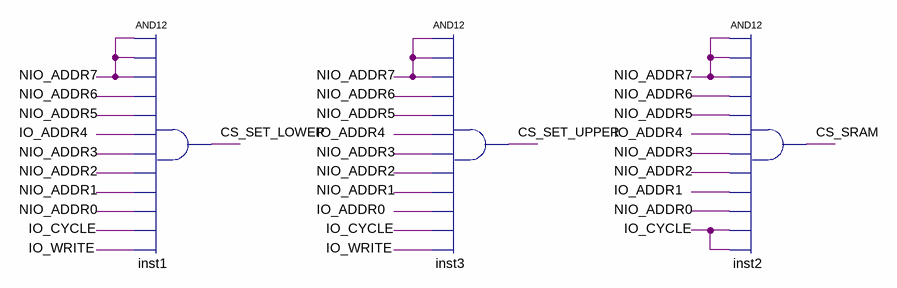
[diagram p0: schematic sheet]
// Quartus schematic Decoders.bdf as structural Verilog: 3 symbols, 0 pins
module Decoders (
);

  wire CS_SET_LOWER, CS_SET_UPPER, CS_SRAM, IO_ADDR0, IO_ADDR1, IO_ADDR4, IO_CYCLE, IO_WRITE, NIO_ADDR0,
       NIO_ADDR1, NIO_ADDR2, NIO_ADDR3, NIO_ADDR5, NIO_ADDR6, NIO_ADDR7;

  and inst1 (CS_SET_LOWER, NIO_ADDR7, NIO_ADDR7, NIO_ADDR7, NIO_ADDR6, NIO_ADDR5, IO_ADDR4, NIO_ADDR3, NIO_ADDR2, NIO_ADDR1, NIO_ADDR0, IO_CYCLE, IO_WRITE);
  and inst3 (CS_SET_UPPER, NIO_ADDR7, NIO_ADDR7, NIO_ADDR7, NIO_ADDR6, NIO_ADDR5, IO_ADDR4, NIO_ADDR3, NIO_ADDR2, NIO_ADDR1, IO_ADDR0, IO_CYCLE, IO_WRITE);
  and inst2 (CS_SRAM, NIO_ADDR7, NIO_ADDR7, NIO_ADDR7, NIO_ADDR6, NIO_ADDR5, IO_ADDR4, NIO_ADDR3, NIO_ADDR2, IO_ADDR1, NIO_ADDR0, IO_CYCLE, IO_CYCLE);
endmodule
